# EAGLE design leddriver (EAGLE 9.4.2)
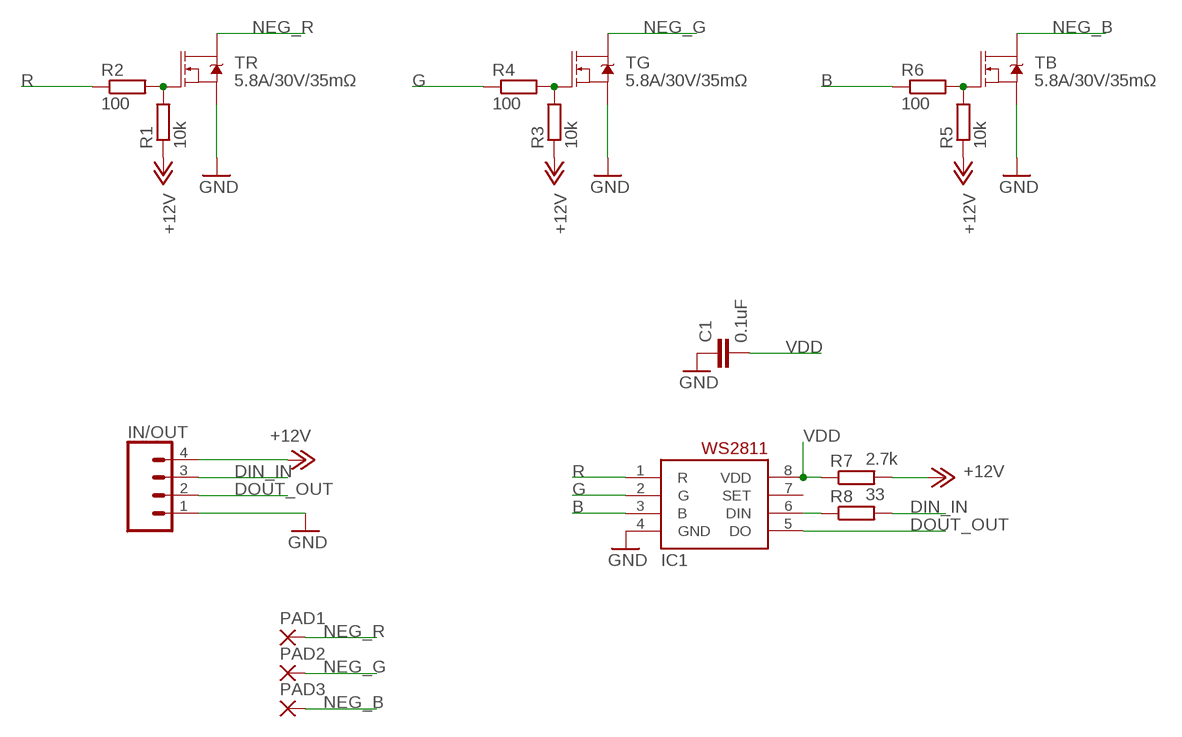
[diagram p0: schematic, sheet 1]

## Parts
C1  0.1uF  C-EUC1206  [C1206]
IC1  WS2811-SOP8  [SO08-SKINNYPADS]
IN/OUT  CONN_04LONGPADS  [1X04_LONGPADS]
PAD1  3,81/1,4  [3,81/1,4]
PAD2  3,81/1,4  [3,81/1,4]
PAD3  3,81/1,4  [3,81/1,4]
R1  10k  R-EU_R0805  [R0805]
R2  100  R-EU_R0805  [R0805]
R3  10k  R-EU_R0805  [R0805]
R4  100  R-EU_R0805  [R0805]
R5  10k  R-EU_R0805  [R0805]
R6  100  R-EU_R0805  [R0805]
R7  2.7k  R-EU_R0805  [R0805]
R8  33  R-EU_R0805  [R0805]
TB  5.8A/30V/35mΩ  MOSFET-NCH-AO3404A  [SOT23-3]
TG  5.8A/30V/35mΩ  MOSFET-NCH-AO3404A  [SOT23-3]
TR  5.8A/30V/35mΩ  MOSFET-NCH-AO3404A  [SOT23-3]

## Nets
+12V: IN/OUT.4 R1.1 R3.1 R5.1 R7.2
B: IC1.3(B) R6.1
DIN_IN: IN/OUT.3 R8.2
DOUT_OUT: IC1.5(DO) IN/OUT.2
G: IC1.2(G) R4.1
GND: C1.1 IC1.4(GND) IN/OUT.1 TB.2(S) TG.2(S) TR.2(S)
N$1: IC1.6(DIN) R8.1
N$2: R3.2 R4.2 TG.1(G)
N$3: R5.2 R6.2 TB.1(G)
N$4: R1.2 R2.2 TR.1(G)
NEG_B: PAD3.1(P) TB.3(D)
NEG_G: PAD2.1(P) TG.3(D)
NEG_R: PAD1.1(P) TR.3(D)
R: IC1.1(R) R2.1
VDD: C1.2 IC1.8(VDD) R7.1
Unconnected: IC1.7(SET)

## Library data of the parts
C1 = rcl:C-EU: CAPACITOR, European symbol; SPICEPREFIX: C
IC1 = adafruit_wsled:WS2811
IN/OUT = SparkFun-Connectors:CONN_04: Multi connection point. Often used as Generic Header-pin footprint for 0.1 inch spaced/style header connections On any of the 0.1 inch spaced packages, you can populate with these: Break Away Headers - Straight <https://www.sparkfun.com/products/116> (PRT-00116) Break Away Male Headers - Right Angle <https://www.sparkfun.com/products/553> (PRT-00553) Female Headers <https://www.sparkfun.com/products/115> (PRT-00115) Break Away Headers - Machine Pin <https://www.sparkfun.com/products/117> (PRT-00117) Break Away Female Headers - Swiss Machine Pin <https://www.sparkfun.com/products/743> (PRT-00743) For SCREWTERMINALS and SPRING TERMINALS visit here: Screw Terimnals on SparkFun.com <https://www.sparkfun.com/search/results?term=Screw+Terminals> (5mm/3.5mm/2.54mm spacing) This device is also useful as a general connection point to wire up your design to another part of your project. Our various solder wires solder well into these plated through hole pads. Hook-Up Wire - Assortment (Stranded, 22 AWG) <https://www.sparkfun.com/products/11375> (PRT-11375) Hook-Up Wire - Assortment (Solid Core, 22 AWG) <https://www.sparkfun.com/products/11367> (PRT-11367) View the entire wire category on our website here <https://www.sparkfun.com/categories/141> Special notes: Molex polarized connector foot print use with SKU : PRT-08231 with associated crimp pins and housings. 1MM SMD Version SKU: PRT-10208; PROD_ID: CONN-09696
PAD1-PAD3 = wirepad:3,81/1,4: THROUGH-HOLE PAD
R1-R8 = rcl:R-EU_: RESISTOR, European symbol; SPICEPREFIX: R
TB TG TR = SparkFun-DiscreteSemi:MOSFET-NCH: N-channel MOSFETs Voltage controlled devices that allow control of high current outputs. SparkFun Products: SparkFun OpenScale <https://www.sparkfun.com/products/13261> SparkFun Digital Sandbox <https://www.sparkfun.com/products/12651> SparkFun Monster Moto Shield <https://www.sparkfun.com/products/10182> SparkFun MOSFET Power Controller <https://www.sparkfun.com/products/11214>; PROD_ID: TRANS-12988

## Board
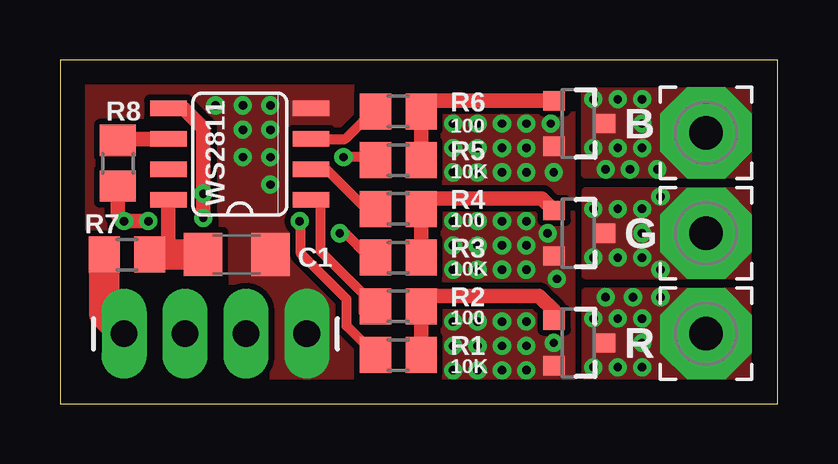
[diagram p1: board, top side]
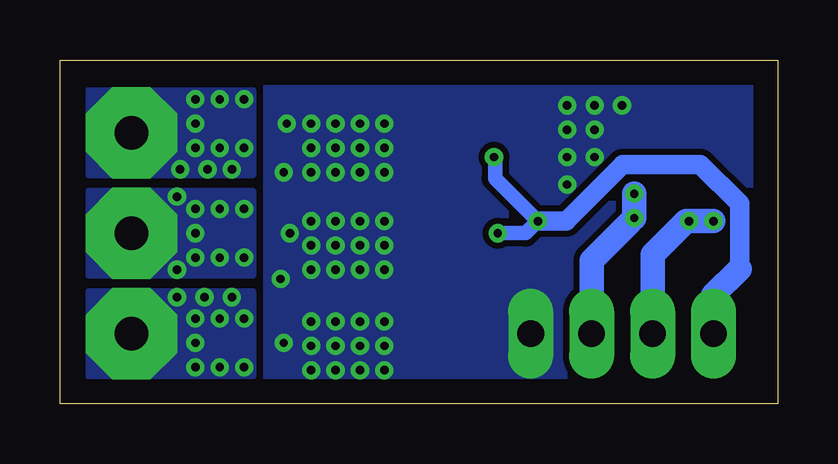
[diagram p2: board, bottom side, seen from below]

Size 29.9 x 14.34 mm. Coordinates in mm from the lower left corner, seen from the top.
Outline: 0,0 29.9,0 29.9,14.34 0,14.34 0,0
Copper layers (1*16): Top 0.035mm / dielectric 1.5mm / Bottom 0.035mm
Design rules "default *": minimum track width 6mil, minimum drill 0.35mm, track to track 6mil, track to pad 6mil, pad to pad 6mil, via to via 6mil, smd to smd 6mil, copper to edge 40mil, drill to drill 6mil, minimum pad ring 10mil, minimum via ring 8mil, stop-mask expansion 4mil, vias tented up to drill 100mil, thermal gap 10mil

### Footprints (pad centres in the part's own frame; a part is rotated, then mirrored left to right if it is on the bottom)
C1206 = smd 1.6 x 1.8: 1 -1.4,0; 2 1.4,0
SO08-SKINNYPADS = smd 0.66 x 1.524: 1 -1.905,-2.973; 2 -0.635,-2.973; 3 0.635,-2.973; 4 1.905,-2.973; 5 1.905,2.973; 6 0.635,2.973; 7 -0.635,2.973; 8 -1.905,2.973
1X04_LONGPADS = drill 1.118 pad 1.88 long: 1 0,0; 2 2.54,0; 3 5.08,0; 4 7.62,0
3,81/1,4 = drill 1.397 pad 3.81 octagon: 1 0,0
R0805 = smd 1.3 x 1.5: 1 -0.95,0; 2 0.95,0
SOT23-3 = smd 0.8 x 0.9: 1 -0.95,-1; 2 0.95,-1; 3 0,1.1

### Placement (x,y rotation side)
C1  7.37,6.22 180 top
IC1  7.49,10.41 90 top
IN/OUT  10.29,2.92 180 top
PAD1  26.92,2.92 0 top
PAD2  26.92,7.11 0 top
PAD3  26.92,11.3 0 top
R1  14.1,2.03 0 top
R2  14.1,4.06 0 top
R3  14.1,6.1 0 top
R4  14.1,8.13 0 top
R5  14.1,10.16 0 top
R6  14.1,12.19 0 top
R7  2.79,6.22 180 top
R8  2.41,10.03 270 top
TB  21.59,11.68 270 top
TG  21.59,7.11 270 top
TR  21.59,2.54 270 top

### Tracks (layer width: path | path; a pad name or v marks a point on that pad's centre or on a via)
+12V  (via drill 0.35)
  Top 0.406: v11.66,7.11 11.88,7.11 12.89,6.1 R3.1 | R5.1 13.02,10.29 v11.81,10.29 | v9.99,7.62 10.04,7.57 10.04,6.26 11.94,4.36 11.94,3.24 R1.1
  Top 1.27: IN/OUT.4 1.84,3.74 R7.2
  Bottom 0.61: v11.66,7.11 10.5,7.11 v9.99,7.62 11.77,9.4 11.77,10.24 v11.81,10.29
  Bottom 0.813: v9.99,7.62 8.8,7.62 6.44,9.98 3.21,9.98 1.58,8.35 1.58,5.62
  Bottom 1.016: IN/OUT.4 2.67,4.53 1.58,5.62
B
  Top 0.406: IC1.3 11.88,11.05 13.02,12.19 R6.1
DIN_IN  (via drill 0.35)
  Top 0.61: v3.68,7.62 v2.67,7.62 2.41,7.87 R8.2
  Bottom 1.016: IN/OUT.3 5.21,6.22 3.81,7.62 v3.68,7.62 v2.67,7.62
DOUT_OUT  (via drill 0.35)
  Top 0.61: IC1.5 5.16,12.32 5.97,11.5 v5.97,7.75 v5.97,8.76
  Bottom 0.61: v5.97,7.75 6.16,7.56
  Bottom 1.016: 6.16,7.56 7.75,5.97 IN/OUT.2 | v5.97,8.76 v5.97,7.75
G
  Top 0.305: IC1.2 11.1,9.78
  Top 0.406: R4.1 12.75,8.13 11.1,9.78
GND  (via drill 0.35)
  other vias: 16.38,11.68 16.38,7.62 16.38,3.43 17.4,11.68 18.41,11.68 19.43,11.68 16.38,10.67 16.38,9.65 17.4,10.67 17.4,9.65 18.41,9.65 18.41,10.67 19.43,9.65 20.57,9.65 20.45,11.68 16.38,2.41 16.38,1.4 17.4,3.43 17.4,2.41 17.4,1.4 18.41,3.43 18.41,2.41 18.41,1.4 19.43,1.4 19.43,2.41 17.4,7.62 18.41,7.62 16.38,6.6 17.4,6.6 18.41,6.6 16.38,5.59 17.4,5.59 18.41,5.59 19.43,7.62 20.32,7.11 19.43,5.59 20.7,5.21 7.62,12.45 8.76,12.45 7.62,11.43 8.76,11.43 8.76,10.29 7.62,10.29 8.76,9.14 6.48,12.45 19.43,3.43 20.57,2.54 19.43,6.6 19.43,10.67
  pour Top (isolate 0.254, no thermals): -0.63,14.1 13.46,14.1 13.46,0 -0.63,0
  pour Bottom (isolate 0.254, no thermals): -0.25,14.22 -0.25,-0.25 21.21,-0.25 21.21,14.22
  pour Top (isolate 0.254, no thermals): 15.88,12.19 21.34,12.19 21.34,8.64 15.88,8.64
  pour Top (isolate 0.254, no thermals): 15.88,8 21.34,8 21.34,4.06 15.88,4.06
  pour Top (isolate 0.254, no thermals): 15.88,3.94 21.34,3.94 21.34,0.25 15.88,0.25
N$1
  Top 0.61: R8.1 2.48,11.05 IC1.6
N$2
  Top 0.61: R3.2 R4.2 15.49,8.57 20.08,8.57 TG.1
N$3
  Top 0.61: R5.2 R6.2 15.49,12.63 TB.1
N$4
  Top 0.61: R1.2 R2.2 15.49,4.51 19.96,4.51 20.59,3.87 TR.1
NEG_B  (via drill 0.35)
  other vias: 22.23,12.7 23.24,12.7 24.26,12.7 24.26,11.68 24.26,10.67 23.24,10.67 22.23,10.67 23.75,9.78 22.73,9.78 24.89,9.78
  pour Top (no thermals): 28.7,9.53 21.84,9.53 21.84,13.08 28.7,13.08
  pour Bottom (no thermals): 21.84,13.08 21.84,9.53 28.7,9.53 28.7,13.08
NEG_G  (via drill 0.35)
  other vias: 22.23,8.13 23.24,8.13 24.26,8.13 24.26,7.11 24.26,6.1 23.24,6.1 22.23,6.1 25.02,8.64 25.02,5.59
  pour Top (no thermals): 28.7,8.89 21.84,8.89 21.84,5.33 28.7,5.33
  pour Bottom (no thermals): 21.84,8.89 21.84,5.33 28.7,5.33 28.7,8.89
NEG_R  (via drill 0.35)
  other vias: 22.23,3.56 23.24,3.56 24.26,3.56 24.26,2.54 24.26,1.52 23.24,1.52 22.23,1.52 22.73,4.45 23.88,4.45 25.02,4.45
  pour Top (no thermals): 28.7,4.7 21.84,4.7 21.84,1.14 28.7,1.14
  pour Bottom (no thermals): 21.84,4.7 21.84,1.14 28.7,1.14 28.7,4.7
R
  Top 0.406: R2.1 12.89,4.06 12.64,3.81 12.64,4.57 10.85,6.36 10.85,8.51 IC1.1
VDD
  Top 0.61: IC1.8 4.52,6.4 4.7,6.22
  Top 1.27: R7.1 4.7,6.22 C1.2

### Text on the board
tNames: R8 | R6 | 100 | B | R5 | 10K | WS2811 | R4 | R7 | 100 | R3 | G | C1 | 10K | R2 | 100 | R1 | R | 10K